# Altium project 计算器.PrjPCB
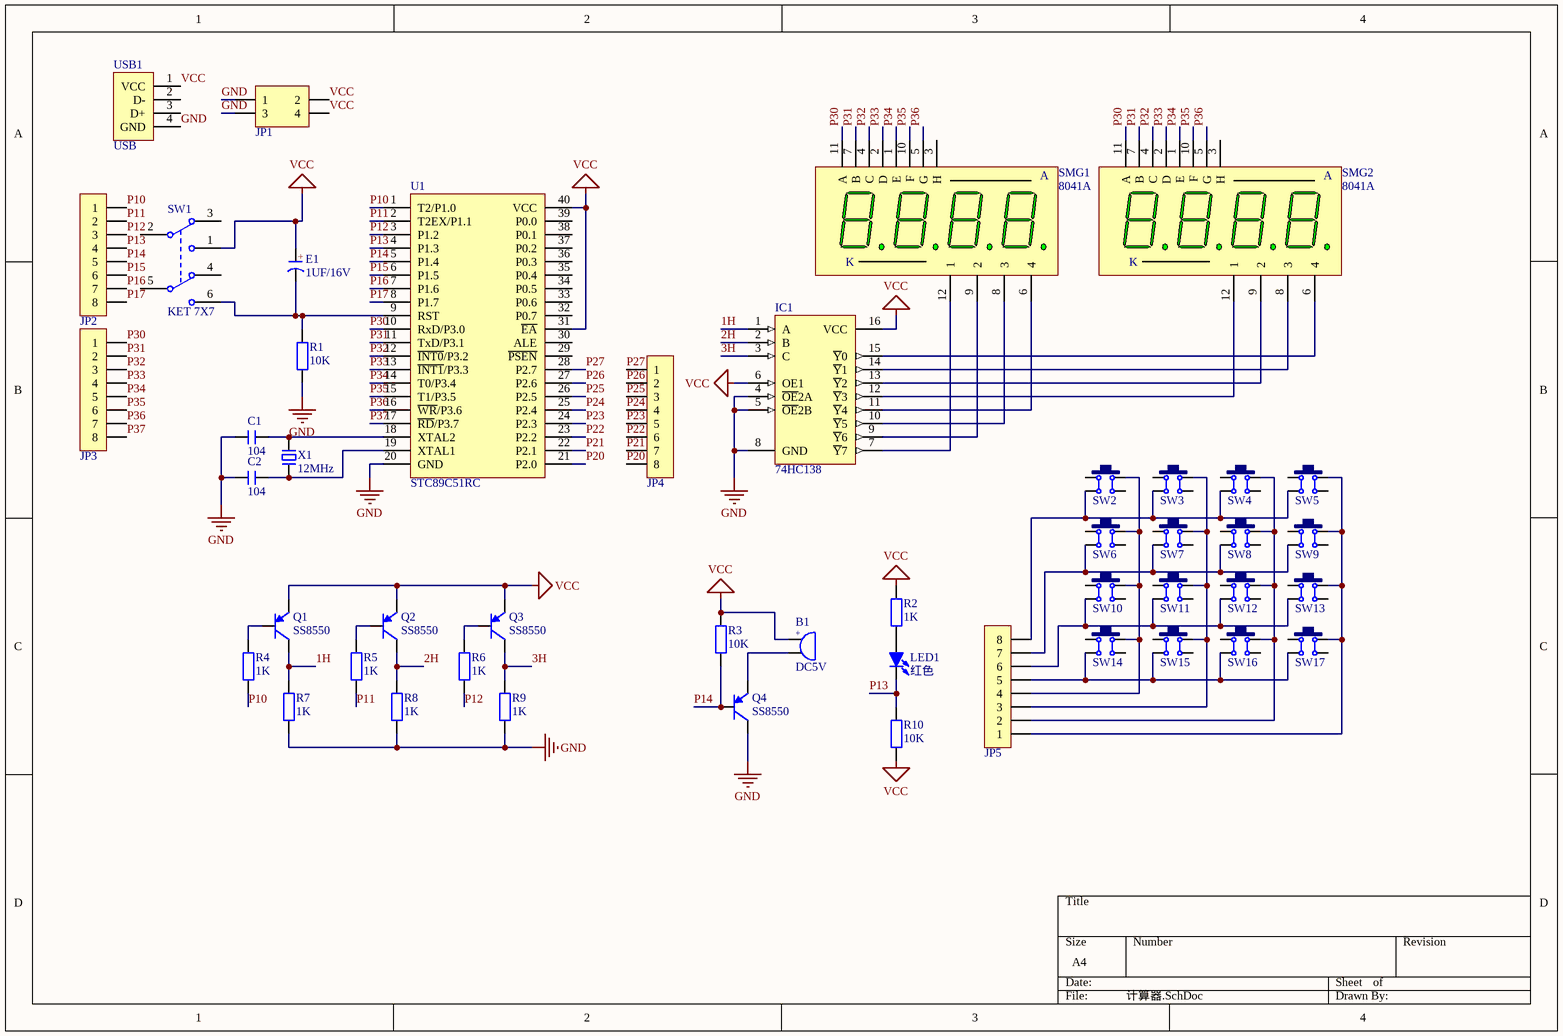
[diagram p0: 计算器.SchDoc]
1 sheet, 47 parts. Net scope: global (net labels, ports and power ports of the same name join across sheets).
Board file: 计算器.PcbDoc

## Sheet 计算器.SchDoc
size A4

### Parts
B1  DC5V  [BEEP 5x9x5.5]
C1  104  [CC 1.8*3.6]
C2  104  [CC 1.8*3.6]
E1  1UF/16V  [CAP 1.5*4*8]
IC1  74HC138  [DIP16-300]
JP1  Header2X2  [HDR-2X2]  (value not drawn)
JP2  HDR-1X8  [HDR-1X8]  (value not drawn)
JP3  HDR-1X8  [HDR-1X8]  (value not drawn)
JP4  HDR-1X8  [HDR-1X8]  (value not drawn)
JP5  HDR-1X8  [HDR-1X8]  (value not drawn)
LED1  红色  [LED 5MM-B]
Q1  SS8550  [TO92A]
Q2  SS8550  [TO92A]
Q3  SS8550  [TO92A]
Q4  SS8550  [TO92A]
R1  10K  [RS 1/4W]
R2  1K  [RS 1/4W]
R3  10K  [RS 1/4W]
R4  1K  [RS 1/4W]
R5  1K  [RS 1/4W]
R6  1K  [RS 1/4W]
R7  1K  [RS 1/4W]
R8  1K  [RS 1/4W]
R9  1K  [RS 1/4W]
R10  10K  [RS 1/4W]
SMG1  8041A  [SMG 0.8-4P]
SMG2  8041A  [SMG 0.8-4P]
SW1  KET 7X7  [KFT DIP-7X7]
SW2  6x6x5  [TSW DIP-6*6*6]  (value not drawn)
SW3  6x6x5  [TSW DIP-6*6*6]  (value not drawn)
SW4  6x6x5  [TSW DIP-6*6*6]  (value not drawn)
SW5  6x6x5  [TSW DIP-6*6*6]  (value not drawn)
SW6  6x6x5  [TSW DIP-6*6*6]  (value not drawn)
SW7  6x6x5  [TSW DIP-6*6*6]  (value not drawn)
SW8  6x6x5  [TSW DIP-6*6*6]  (value not drawn)
SW9  6x6x5  [TSW DIP-6*6*6]  (value not drawn)
SW10  6x6x5  [TSW DIP-6*6*6]  (value not drawn)
SW11  6x6x5  [TSW DIP-6*6*6]  (value not drawn)
SW12  6x6x5  [TSW DIP-6*6*6]  (value not drawn)
SW13  6x6x5  [TSW DIP-6*6*6]  (value not drawn)
SW14  6x6x5  [TSW DIP-6*6*6]  (value not drawn)
SW15  6x6x5  [TSW DIP-6*6*6]  (value not drawn)
SW16  6x6x5  [TSW DIP-6*6*6]  (value not drawn)
SW17  6x6x5  [TSW DIP-6*6*6]  (value not drawn)
U1  STC89C51RC  [DIP40-600]
USB1  USB  [USB-A/S_A]
X1  12MHz  [XTAL-3X10]

### Nets
GND: C1.1 C2.1 IC1.4(~{OE}2A) IC1.5(~{OE}2B) IC1.8(GND) JP1.1 JP1.3 Q4.3(C) R1.1 R7.1 R8.1 R9.1 U1.20(GND) USB1.4(GND)
VCC: B1.1 E1.1(A) IC1.6(OE1) IC1.16(VCC) JP1.2 JP1.4 Q1.1(E) Q2.1(E) Q3.1(E) R2.2 R3.2 R10.1 SW1.1(NC1) U1.31(~{EA}) U1.40(VCC) USB1.1(VCC)
1H: IC1.1(A) Q1.3(C) R7.2
2H: IC1.2(B) Q2.3(C) R8.2
3H: IC1.3(C) Q3.3(C) R9.2
P10: JP2.1 R4.1 U1.1(T2/P1.0)
P11: JP2.2 R5.1 U1.2(T2EX/P1.1)
P12: JP2.3 R6.1 U1.3(P1.2)
P13: JP2.4 LED1.2(K) R10.2 U1.4(P1.3)
P14: JP2.5 Q4.2(B) R3.1 U1.5(P1.4)
P15: JP2.6 U1.6(P1.5)
P16: JP2.7 U1.7(P1.6)
P17: JP2.8 U1.8(P1.7)
P20: JP4.8 U1.21(P2.0)
P21: JP4.7 U1.22(P2.1)
P22: JP4.6 U1.23(P2.2)
P23: JP4.5 U1.24(P2.3)
P24: JP4.4 U1.25(P2.4)
P25: JP4.3 U1.26(P2.5)
P26: JP4.2 U1.27(P2.6)
P27: JP4.1 U1.28(P2.7)
P30: JP3.1 SMG1.11(A) SMG2.11(A) U1.10(RxD/P3.0)
P31: JP3.2 SMG1.7(B) SMG2.7(B) U1.11(TxD/P3.1)
P32: JP3.3 SMG1.4(C) SMG2.4(C) U1.12(~{INT0}/P3.2)
P33: JP3.4 SMG1.2(D) SMG2.2(D) U1.13(~{INT1}/P3.3)
P34: JP3.5 SMG1.1(E) SMG2.1(E) U1.14(T0/P3.4)
P35: JP3.6 SMG1.10(F) SMG2.10(F) U1.15(T1/P3.5)
P36: JP3.7 SMG1.5(G) SMG2.5(G) U1.16(~{WR}/P3.6)
P37: JP3.8 U1.17(~{RD}/P3.7)
NetB1_2: B1.2 Q4.1(E)
NetC1_2: C1.2 U1.18(XTAL2) X1.2
NetC2_2: C2.2 U1.19(XTAL1) X1.1
NetE1_2: E1.2(K) R1.2 SW1.6(NC2) U1.9(RST)
NetIC1_7: IC1.7(~{Y}7) SMG1.12(1)
NetIC1_9: IC1.9(~{Y}6) SMG1.9(2)
NetIC1_10: IC1.10(~{Y}5) SMG1.8(3)
NetIC1_11: IC1.11(~{Y}4) SMG1.6(4)
NetIC1_12: IC1.12(~{Y}3) SMG2.12(1)
NetIC1_13: IC1.13(~{Y}2) SMG2.9(2)
NetIC1_14: IC1.14(~{Y}1) SMG2.8(3)
NetIC1_15: IC1.15(~{Y}0) SMG2.6(4)
NetJP5_1: JP5.1 SW5.2 SW9.2 SW13.2 SW17.2
NetJP5_2: JP5.2 SW4.2 SW8.2 SW12.2 SW16.2
NetJP5_3: JP5.3 SW3.2 SW7.2 SW11.2 SW15.2
NetJP5_4: JP5.4 SW2.2 SW6.2 SW10.2 SW14.2
NetJP5_5: JP5.5 SW14.4 SW15.4 SW16.4 SW17.4
NetJP5_6: JP5.6 SW10.4 SW11.4 SW12.4 SW13.4
NetJP5_7: JP5.7 SW6.4 SW7.4 SW8.4 SW9.4
NetJP5_8: JP5.8 SW2.4 SW3.4 SW4.4 SW5.4
NetLED1_1: LED1.1(A) R2.1
NetQ1_2: Q1.2(B) R4.2
NetQ2_2: Q2.2(B) R5.2
NetQ3_2: Q3.2(B) R6.2

Not connected (* = marked no-connect by the designer): SMG1 3(H); SMG2 3(H); SW1 2(COM2) 3(NO1) 4(NO2) 5(COM2); SW2 1 3; SW3 1 3; SW4 1 3; SW5 1 3; SW6 1 3; SW7 1 3; SW8 1 3; SW9 1 3; SW10 1 3; SW11 1 3; SW12 1 3; SW13 1 3; SW14 1 3; SW15 1 3; SW16 1 3; SW17 1 3; U1 29(~{PSEN}) 30(ALE) 32(P0.7) 33(P0.6) 34(P0.5) 35(P0.4) 36(P0.3) 37(P0.2) 38(P0.1) 39(P0.0); USB1 2(D-) 3(D+)

### Notes on the sheet
- (in symbol 8041A) K
- (in symbol BEEP) +
- (in symbol C-CAP) +

### Library data of the parts
B1 = BEEP: 蜂鸣器; 版权归属: 黎明电子style; BOM名称: 蜂鸣器; 学习资源: https://lmdzstyle.taobao.com/
C1 C2 = C-CC: 直插瓷片电容; 版权归属: 黎明电子style; BOM名称: 直插瓷片电容; 学习资源: https://lmdzstyle.taobao.com/
E1 = C-CAP: 直插电解电容; 版权归属: 黎明电子style; BOM名称: 直插电解电容; 学习资源: https://lmdzstyle.taobao.com/
IC1 = 74HC138: 138译码器; 版权归属: 黎明电子style; 学习资源: https://lmdzstyle.taobao.com/; BOM名称: 138译码器
JP1 = Header 2X2: 2*2P接插件; 版权归属: 黎明电子style; BOM名称: 2*2P接插件; 学习资源: https://lmdzstyle.taobao.com/
JP2-JP5 = Header 8: 8P接插件; 版权归属: 黎明电子style; BOM名称: 8P接插件; 学习资源: https://lmdzstyle.taobao.com/
LED1 = LED-5MM: 5mm插件LED; 版权归属: 黎明电子style; BOM名称: 5mm插件LED; 学习资源: https://lmdzstyle.taobao.com/
Q1-Q4 = 8550-DIP: 高频放大-PNP型; 版权归属: 黎明电子style; 属性: 40V 1.5A 1W 100MHZ; BOM名称: 高频放大-PNP型; 学习资源: https://lmdzstyle.taobao.com/
R1-R10 = R-CRR: 直插色环电阻; BOM名称: 色环电阻; 版权归属: 黎明电子style; 学习资源: https://lmdzstyle.taobao.com/
SMG1 SMG2 = 8041A: 0.8寸4位共阴数码管; 版权归属: 黎明电子style; BOM名称: 0.8寸4位共阴; 学习资源: https://lmdzstyle.taobao.com/
SW1 = KET 7X7: 7*7自锁开关; 版权归属: 黎明电子style; BOM名称: 7*7自锁开关; 学习资源: https://lmdzstyle.taobao.com/
SW2-SW17 = TSW DIP-6x6: 直插6x6轻触开关; 版权归属: 黎明电子style; BOM名称: 直插6x6轻触开关; 学习资源: https://lmdzstyle.taobao.com/
U1 = STC89C51RC: STC单片机; 版权归属: 黎明电子style; BOM名称: STC单片机; 学习资源: https://lmdzstyle.taobao.com/
USB1 = USB-A/S: USB-A型母接口; 版权归属: 黎明电子style; BOM名称: USB-A型母接口; 学习资源: https://lmdzstyle.taobao.com/
X1 = XTAL-2: 2脚晶振; 版权归属: 黎明电子style; BOM名称: 2脚晶振; 学习资源: https://lmdzstyle.taobao.com/